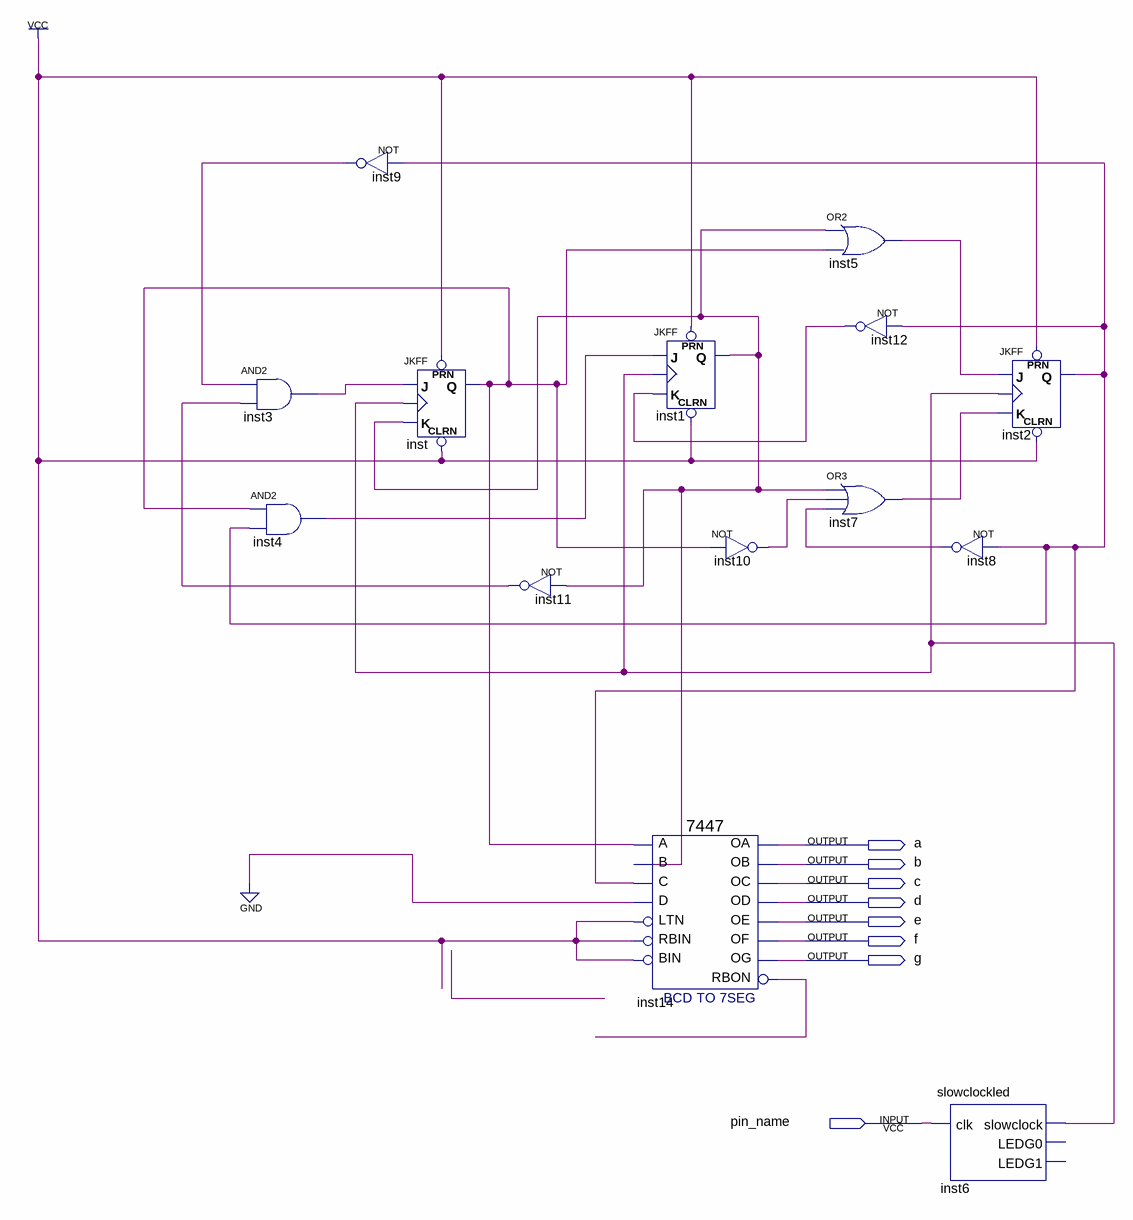
[diagram p0: schematic sheet]
// Quartus schematic final.bdf as structural Verilog: 14 symbols, 8 pins
module \final  (
  input  pin_name,
  output a,
  output b,
  output c,
  output d,
  output e,
  output f,
  output g
);

  wire inst1_q, inst2_q, inst3_out, inst4_out, inst5_out, inst6_slowclock, inst7_out, inst8_out, inst9_out,
       inst10_out, inst11_out, inst12_out, inst14_rbon, inst_q;

  and inst3 (inst3_out, inst9_out, inst11_out);
  and inst4 (inst4_out, inst_q, inst2_q);
  not inst9 (inst9_out, inst2_q);
  JKFF inst (.PRN(1'b1), .CLRN(1'b1), .K(inst1_q), .J(inst3_out), .CLK(inst6_slowclock), .Q(inst_q));
  not inst11 (inst11_out, inst1_q);
  JKFF inst1 (.PRN(1'b1), .CLRN(1'b1), .K(inst12_out), .J(inst4_out), .CLK(inst6_slowclock), .Q(inst1_q));
  \7447  inst14 (
    .LTN(1'b1), .B(inst1_q), .C(inst2_q), .D(1'b0), .RBIN(1'b1), .BIN(1'b1), .A(inst_q), .OB(b), .OC(c),
    .OE(e), .OD(d), .OF(f), .OG(g), .OA(a), .RBON(inst14_rbon));
  not inst10 (inst10_out, inst_q);
  or inst5 (inst5_out, inst1_q, inst_q);
  or inst7 (inst7_out, inst1_q, inst10_out, inst8_out);
  not inst12 (inst12_out, inst2_q);
  not inst8 (inst8_out, inst2_q);
  slowclockled inst6 (.clk(pin_name), .slowclock(inst6_slowclock));  // open: LEDG0, LEDG1
  JKFF inst2 (.PRN(1'b1), .CLRN(1'b1), .K(inst7_out), .J(inst5_out), .CLK(inst6_slowclock), .Q(inst2_q));
endmodule
